# Altium schematic sheet Drive2Pin.SchDoc
size B
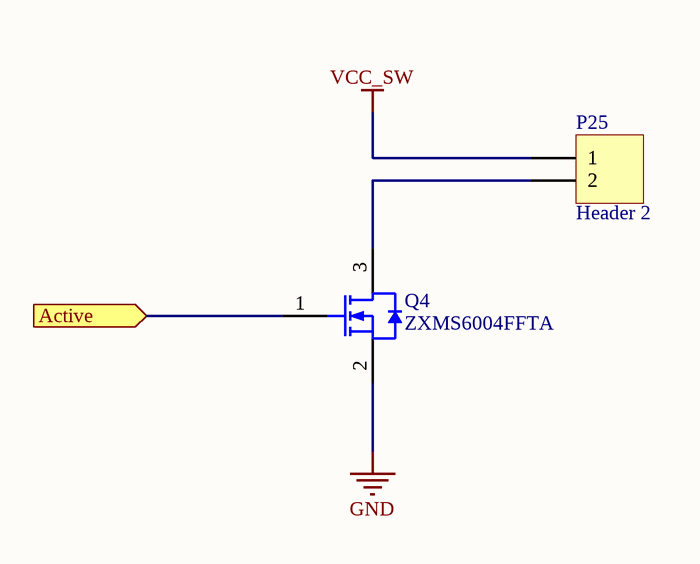
[diagram p0: Drive2Pin.SchDoc]

## Parts
P25  Header 2  [HDR1X2]
Q4  ZXMS6004FFTA  [DIOD-SOT23F-3_V]

## Ports
Active (in)

## Nets
GND: Q4.2(S)
VCC_SW: P25.1
Active: Q4.1(G) ; port Active
NetP25_2: P25.2 Q4.3(D)

## Library data of the parts
P25 = Header 2: Header, 2-Pin; LatestRevisionDate: 17-Jul-2002; LatestRevisionNote: Re-released for DXP Platform.; Publisher: Altium Limited
Q4 = CMP-2000-07435-1: N-Channel Self Protected Enhancement Mode Intellifet(TM) MOSFET, 60 V, 1.3 A, -40 to 150 degC, 3-Pin SOT23, RoHS, Tape and Reel; Manufacturer: Diodes Inc; Voltage - Load: 60V(Max); Current - Output (Max): 1.3A; Featured Product: ZXMS6004FF60VN-ChannelMOSFET; Product Training Modules: IntelliFET's; Rds On (Typ): 350mOhm; Input Type: Non-Inverting; Interface: On/Off; Number of Outputs: 1; Ratio - Input: Output:1:1; Output Configuration: LowSide; Voltage - Supply (Vcc/Vdd): 3.3V,5V; PCN Design/Specification: PartMarkingUpdate25/Sep/2015; Switch Type: GeneralPurpose; Fault Protection: CurrentLimiting(Fixed),OverTemperature,OverVoltage; Other Names: ZXMS6004FFTR; Category: IntegratedCircuits(ICs); Operating Temperature: -40°C~150°C(TJ); Features: AutoRestart; Manufacturer URL: http://www.diodes.com/; Datasheet URL: https://datasheet.ciiva.com/15109/getdatasheetpartid-411522-15109086.pdf; Package Reference: SOT23F-3; Family: PMIC-PowerDistributionSwitches,LoadDrivers; Package Description: 3-Pin Small Outline Transistor Flat Lead, Body 2.9 x 1.6 mm, Pitch 0.95 mm; Output Type: N-Channel; Supplier Device Package: SOT-23F; RoHS Information: RoHSCertofCompliance; Package / Case: SOT-23-3FlatLeads; Packaging: Tape&Reel(TR); Datasheet Version: Rev. 6-2, 10/2014; Mounting Technology: SurfaceMount; Series: Automotive,AEC-Q101,INTELLIFET®; Online Catalog: GeneralPurpose; Standard Package: 3,000